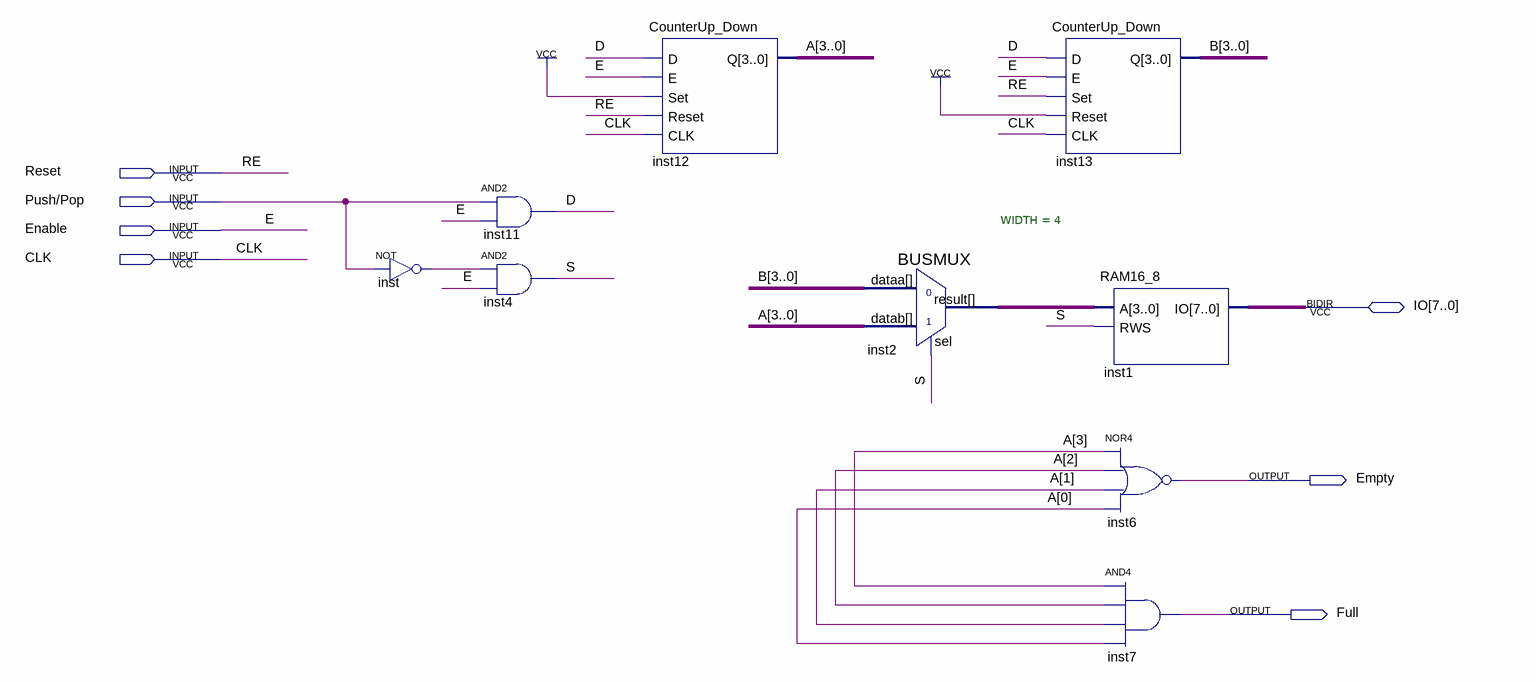
[diagram p0: schematic sheet]
// Quartus schematic LIFO.bdf as structural Verilog: 9 symbols, 7 pins
module LIFO (
  input  Reset,
  input  \Push/Pop ,
  input  Enable,
  input  CLK,
  inout  [7:0] IO,
  output Empty,
  output Full
);

  wire D, inst_out, S;
  wire [3:0] A, B, inst2_result;

  not inst (inst_out, \Push/Pop );
  and inst11 (D, \Push/Pop , Enable);
  and inst4 (S, inst_out, Enable);
  CounterUp_Down inst12 (.D(D), .E(Enable), .Set(1'b1), .Reset(Reset), .CLK(CLK), .Q(A));
  BUSMUX #(.WIDTH(4)) inst2 (.datab(A), .sel(S), .dataa(B), .result(inst2_result));
  CounterUp_Down inst13 (.D(D), .E(Enable), .Set(Reset), .Reset(1'b1), .CLK(CLK), .Q(B));
  RAM16_8 inst1 (.A(inst2_result), .RWS(S), .IO(IO));
  nor inst6 (Empty, A[3], A[2], A[1], A[0]);
  and inst7 (Full, A[3], A[2], A[1], A[0]);

  // Other names for the same wires on the sheet: E = Enable; RE = Reset
endmodule
